# EAGLE design nintendo-hid (EAGLE 7.4.0)

## Sheet 1 of 5: MCU
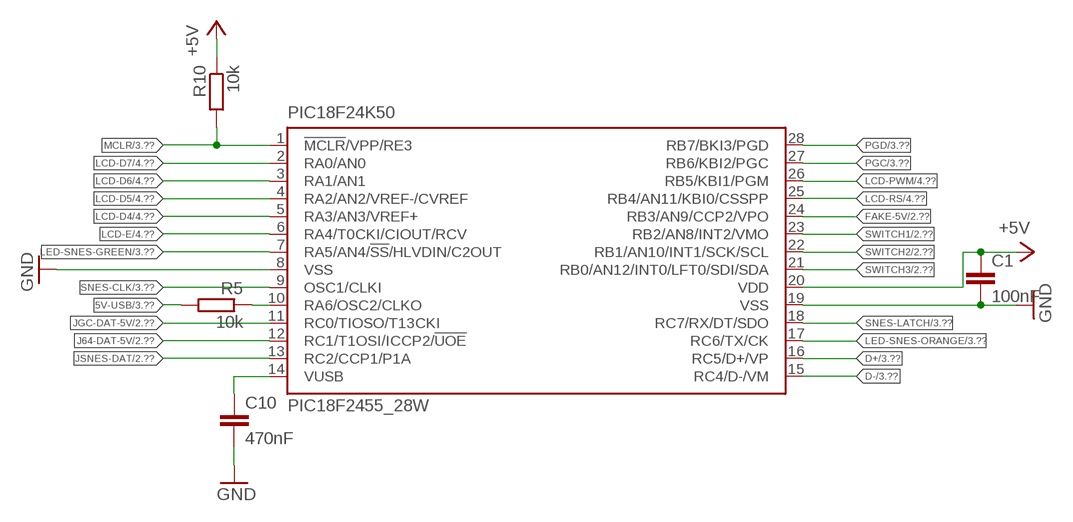
[diagram p0: schematic, sheet 1]

### Parts
C1  100nF  C-EUC0603  [C0603]
C10  470nF  C-EUC0603  [C0603]
PIC18F24K50  PIC18F2455_28W  [SO28W]
R5  10k  R-EU_R0603  [R0603]
R10  10k  R-EU_R0603  [R0603]

### Nets
5V-USB: R5.2 ; also sheet 3,5
+5V: C1.1 PIC18F24K50.20(VDD) R10.1 ; also sheet 2,3,4,5
D+: PIC18F24K50.16(RC5/D+/VP) ; also sheet 3
D-: PIC18F24K50.15(RC4/D-/VM) ; also sheet 3
FAKE-5V: PIC18F24K50.24(RB3/AN9/CCP2/VPO) ; also sheet 2
GND: C1.2 C10.2 PIC18F24K50.8(VSS) PIC18F24K50.19(VSS) ; also sheet 2,3,4,5
J64-DAT-5V: PIC18F24K50.12(RC1/T1OSI/ICCP2/!UOE) ; also sheet 2
JGC-DAT-5V: PIC18F24K50.11(RC0/TIOSO/T13CKI) ; also sheet 2
JSNES-DAT: PIC18F24K50.13(RC2/CCP1/P1A) ; also sheet 2,3
LCD-D4: PIC18F24K50.5(RA3/AN3/VREF+) ; also sheet 4
LCD-D5: PIC18F24K50.4(RA2/AN2/VREF-/CVREF) ; also sheet 4
LCD-D6: PIC18F24K50.3(RA1/AN1) ; also sheet 4
LCD-D7: PIC18F24K50.2(RA0/AN0) ; also sheet 4
LCD-E: PIC18F24K50.6(RA4/T0CKI/CIOUT/RCV) ; also sheet 4
LCD-PWM: PIC18F24K50.26(RB5/KBI1/PGM) ; also sheet 4
LCD-RS: PIC18F24K50.25(RB4/AN11/KBI0/CSSPP) ; also sheet 4
LED-SNES-GREEN: PIC18F24K50.7(RA5/AN4/!SS!/HLVDIN/C2OUT) ; also sheet 3
LED-SNES-ORANGE: PIC18F24K50.17(RC6/TX/CK) ; also sheet 3
MCLR: PIC18F24K50.1(!MCLR!/VPP/RE3) R10.2 ; also sheet 3
N$1: C10.1 PIC18F24K50.14(VUSB)
PGC: PIC18F24K50.27(RB6/KBI2/PGC) ; also sheet 3
PGD: PIC18F24K50.28(RB7/BKI3/PGD) ; also sheet 3
SNES-CLK: PIC18F24K50.9(OSC1/CLKI) ; also sheet 3
SNES-LATCH: PIC18F24K50.18(RC7/RX/DT/SDO) ; also sheet 3
SWITCH1: PIC18F24K50.23(RB2/AN8/INT2/VMO) ; also sheet 2
SWITCH2: PIC18F24K50.22(RB1/AN10/INT1/SCK/SCL) ; also sheet 2
SWITCH3: PIC18F24K50.21(RB0/AN12/INT0/LFT0/SDI/SDA) ; also sheet 2
USB-SENSE: PIC18F24K50.10(RA6/OSC2/CLKO) R5.1

## Sheet 2 of 5: SIGNALS
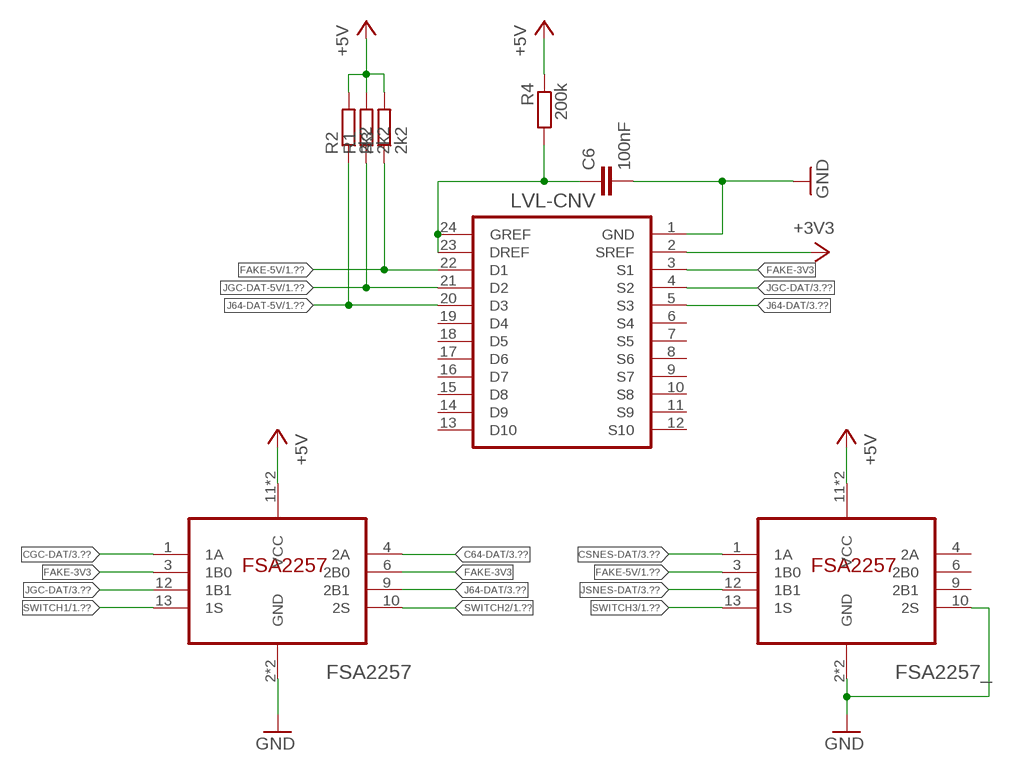
[diagram p1: schematic, sheet 2]

### Parts
C6  100nF  C-EUC0603  [C0603]
FSA2257  FSA2257MTCX  [TSSOP14]
FSA2257_  FSA2257MTCX  [TSSOP14]
LVL-CNV  GTL2010  [TSSOP24]
R1  2k2  R-EU_R0603  [R0603]
R2  2k2  R-EU_R0603  [R0603]
R3  2k2  R-EU_R0603  [R0603]
R4  200k  R-EU_R0603  [R0603]

### Nets
+3V3: LVL-CNV.2(SREF) ; also sheet 3,5
+5V: FSA2257.11(VCC) FSA2257.14(VCC) FSA2257_.11(VCC) FSA2257_.14(VCC) R1.2 R2.2 R3.2 R4.1 ; also sheet 1,3,4,5
C64-DAT: FSA2257.4(2A) ; also sheet 3
CGC-DAT: FSA2257.1(1A) ; also sheet 3
CSNES-DAT: FSA2257_.1(1A) ; also sheet 3
FAKE-3V3: FSA2257.3(1B0) FSA2257.6(2B0) LVL-CNV.3(S1)
FAKE-5V: FSA2257_.3(1B0) LVL-CNV.22(D1) R3.1 ; also sheet 1
GND: C6.2 FSA2257.2(GND) FSA2257.5(GND) FSA2257_.2(GND) FSA2257_.5(GND) FSA2257_.10(2S) LVL-CNV.1(GND) ; also sheet 1,3,4,5
J64-DAT: FSA2257.9(2B1) LVL-CNV.5(S3) ; also sheet 3
J64-DAT-5V: LVL-CNV.20(D3) R2.1 ; also sheet 1
JGC-DAT: FSA2257.12(1B1) LVL-CNV.4(S2) ; also sheet 3
JGC-DAT-5V: LVL-CNV.21(D2) R1.1 ; also sheet 1
JSNES-DAT: FSA2257_.12(1B1) ; also sheet 1,3
N$20: C6.1 LVL-CNV.23(DREF) LVL-CNV.24(GREF) R4.2
SWITCH1: FSA2257.13(1S) ; also sheet 1
SWITCH2: FSA2257.10(2S) ; also sheet 1
SWITCH3: FSA2257_.13(1S) ; also sheet 1
Unconnected: FSA2257_.4(2A) FSA2257_.6(2B0) FSA2257_.9(2B1) LVL-CNV.6(S4) LVL-CNV.7(S5) LVL-CNV.8(S6) LVL-CNV.9(S7) LVL-CNV.10(S8) LVL-CNV.11(S9) LVL-CNV.12(S10) LVL-CNV.13(D10) LVL-CNV.14(D9) LVL-CNV.15(D8) LVL-CNV.16(D7) LVL-CNV.17(D6) LVL-CNV.18(D5) LVL-CNV.19(D4)

## Sheet 3 of 5: CONNECTORS
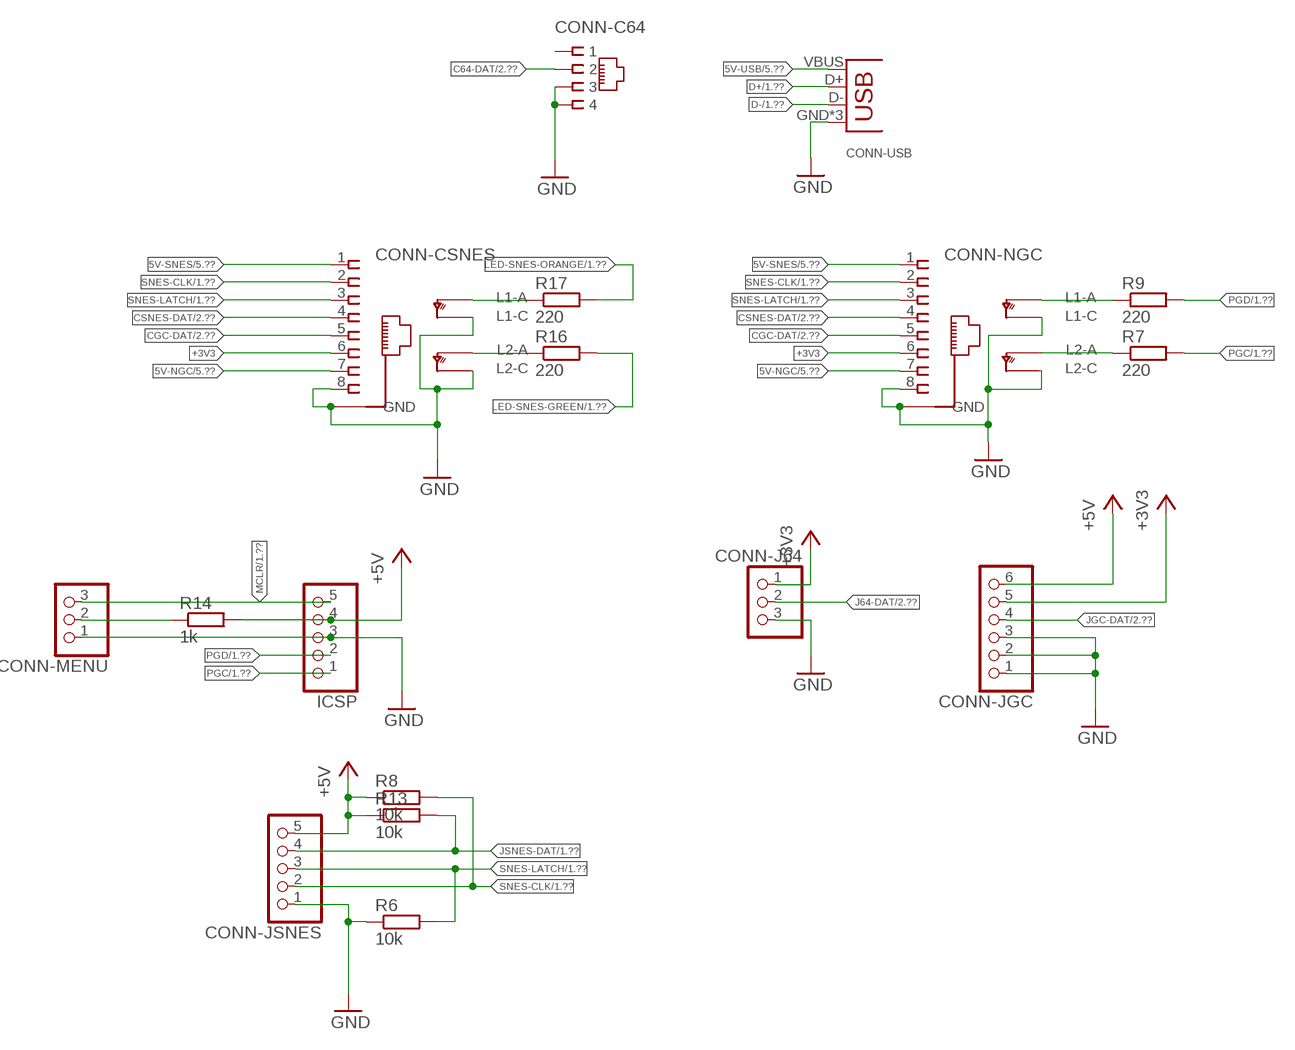
[diagram p2: schematic, sheet 3]

### Parts
CONN-C64  RJ11-6P4C  [RJ11-4C]
CONN-CSNES  RJ45-NIELS  [RJ45-NIELS]
CONN-J64  PINHD-1X3  [1X03]
CONN-JGC  PINHD-1X6  [1X06]
CONN-JSNES  PINHD-1X5  [1X05]
CONN-MENU  PINHD-1X3  [1X03]
CONN-NGC  RJ45-NIELS  [RJ45-NIELS]
CONN-USB  USB-B-NIELS  [USB-B-H]
ICSP  PINHD-1X5  [1X05]
R6  10k  R-EU_R0603  [R0603]
R7  220  R-EU_R0603  [R0603]
R8  10k  R-EU_R0603  [R0603]
R9  220  R-EU_R0603  [R0603]
R13  10k  R-EU_R0603  [R0603]
R14  1k  R-EU_R0603  [R0603]
R16  220  R-EU_R0603  [R0603]
R17  220  R-EU_R0603  [R0603]

### Nets
5V-NGC: CONN-CSNES.7 CONN-NGC.7 ; also sheet 5
5V-SNES: CONN-CSNES.1 CONN-NGC.1 ; also sheet 5
5V-USB: CONN-USB.VBUS ; also sheet 1,5
+3V3: CONN-CSNES.6 CONN-J64.1 CONN-JGC.5 CONN-NGC.6 ; also sheet 2,5
+5V: CONN-JGC.6 CONN-JSNES.5 ICSP.4 R8.1 R13.1 R14.2 ; also sheet 1,2,4,5
C64-DAT: CONN-C64.2 ; also sheet 2
CGC-DAT: CONN-CSNES.5 CONN-NGC.5 ; also sheet 2
CSNES-DAT: CONN-CSNES.4 CONN-NGC.4 ; also sheet 2
D+: CONN-USB.D+ ; also sheet 1
D-: CONN-USB.D- ; also sheet 1
GND: CONN-C64.3 CONN-C64.4 CONN-CSNES.8 CONN-CSNES.GND@5(GND) CONN-CSNES.GND@6(GND) CONN-CSNES.LED-GREEN-C(L2C) CONN-CSNES.LED-ORANGE-C(L1C) CONN-J64.3 CONN-JGC.1 CONN-JGC.2 CONN-JGC.3 CONN-JSNES.1 CONN-MENU.1 CONN-NGC.8 CONN-NGC.GND@5(GND) CONN-NGC.GND@6(GND) CONN-NGC.LED-GREEN-C(L2C) CONN-NGC.LED-ORANGE-C(L1C) CONN-USB.GND CONN-USB.GND@1(GND) CONN-USB.GND@2(GND) ICSP.3 R6.1 ; also sheet 1,2,4,5
J64-DAT: CONN-J64.2 ; also sheet 2
JGC-DAT: CONN-JGC.4 ; also sheet 2
JSNES-DAT: CONN-JSNES.4 R13.2 ; also sheet 1,2
LED-SNES-GREEN: R16.2 ; also sheet 1
LED-SNES-ORANGE: R17.2 ; also sheet 1
MCLR: CONN-MENU.3 ICSP.5 ; also sheet 1
N$4: CONN-CSNES.LED-ORANGE-A(L1A) R17.1
N$5: CONN-CSNES.LED-GREEN-A(L2A) R16.1
N$8: CONN-NGC.LED-ORANGE-A(L1A) R9.1
N$23: CONN-NGC.LED-GREEN-A(L2A) R7.1
PGC: ICSP.1 R7.2 ; also sheet 1
PGD: ICSP.2 R9.2 ; also sheet 1
PWR-LED: CONN-MENU.2 R14.1
SNES-CLK: CONN-CSNES.2 CONN-JSNES.2 CONN-NGC.2 R8.2 ; also sheet 1
SNES-LATCH: CONN-CSNES.3 CONN-JSNES.3 CONN-NGC.3 R6.2 ; also sheet 1
Unconnected: CONN-C64.1

## Sheet 4 of 5: LCD
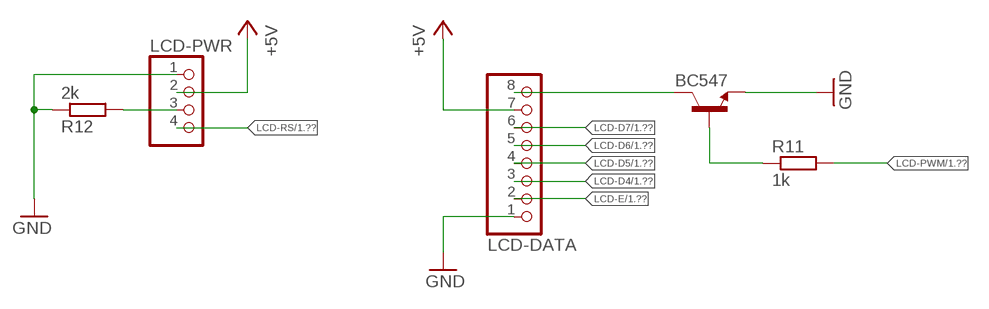
[diagram p3: schematic, sheet 4]

### Parts
BC547  BC547  [TO92]
LCD-DATA  PINHD-1X8  [1X08]
LCD-PWR  PINHD-1X4  [1X04]
R11  1k  R-EU_R0603  [R0603]
R12  2k  R-EU_R0603  [R0603]

### Nets
+5V: LCD-DATA.7 LCD-PWR.2 ; also sheet 1,2,3,5
C: BC547.3(C) LCD-DATA.8
GND: BC547.1(E) LCD-DATA.1 LCD-PWR.1 R12.1 ; also sheet 1,2,3,5
LCD-D4: LCD-DATA.3 ; also sheet 1
LCD-D5: LCD-DATA.4 ; also sheet 1
LCD-D6: LCD-DATA.5 ; also sheet 1
LCD-D7: LCD-DATA.6 ; also sheet 1
LCD-E: LCD-DATA.2 ; also sheet 1
LCD-PWM: R11.2 ; also sheet 1
LCD-RS: LCD-PWR.4 ; also sheet 1
N$19: BC547.2(B) R11.1
VEE: LCD-PWR.3 R12.2

## Sheet 5 of 5: POWER
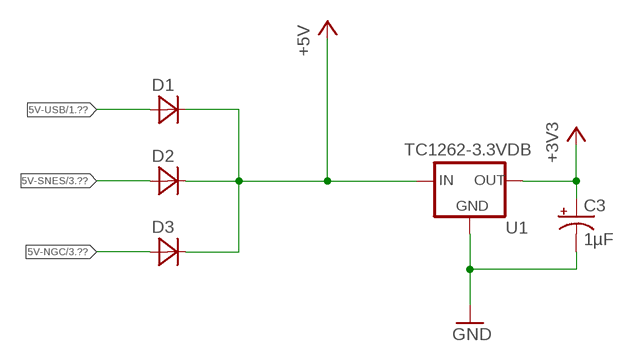
[diagram p4: schematic, sheet 5]

### Parts
C3  1µF  47UF-50V-20%(ELECT)  [PANASONIC_D]
D1  MBR120VLSFT1G  [SOD123]
D2  MBR120VLSFT1G  [SOD123]
D3  MBR120VLSFT1G  [SOD123]
U1  TC1262-3.3VDB  [SOT230P700X180-4N]

### Nets
5V-NGC: D3.2(A) ; also sheet 3
5V-SNES: D2.2(A) ; also sheet 3
5V-USB: D1.2(A) ; also sheet 1,3
+3V3: C3.+ U1.3(OUT) ; also sheet 2,3
+5V: D1.1(C) D2.1(C) D3.1(C) U1.1(IN) ; also sheet 1,2,3,4
GND: C3.- U1.2(GND) U1.4(GND) ; also sheet 1,2,3,4

## Library data of the parts
BC547 = transistor-npn:BC547*: NPN Transistor
C1 C6 C10 = resistor:C-EU: CAPACITOR, European symbol
C3 = SparkFun-Capacitors:47UF-50V-20%(ELECT): CAP-10547; PROD_ID: CAP-10547
CONN-C64 = frank:RJ11-6P4C
CONN-CSNES CONN-NGC = frank:RJ45-NIELS
CONN-J64 CONN-MENU = pinhead:PINHD-1X3: PIN HEADER
CONN-JGC = pinhead:PINHD-1X6: PIN HEADER
CONN-JSNES ICSP = pinhead:PINHD-1X5: PIN HEADER
CONN-USB = frank:USB: USB Connectors
D1-D3 = frank:MBR120VLSFT1G: DIODE, SCHOTTKY, 1A, 20V, SOD-123FL
FSA2257 FSA2257_ = frank:FSA2257MTCX
LCD-DATA = pinhead:PINHD-1X8: PIN HEADER
LCD-PWR = pinhead:PINHD-1X4: PIN HEADER
LVL-CNV = frank:GTL2010
PIC18F24K50 = microchip:PIC18F2*_28: USB Microcontrollers with nanoWatt Technology High-Performance, Enhanced Flash, 28/40/44-Pin, Source: http://ww1.microchip.com/downloads/en/devicedoc/39632c.pdf; MF: MICROCHIP; MPN: PIC18F2455-I/SO; OC_FARNELL: 1579598; OC_NEWARK: 64J3768
R1-R14 R16 R17 = resistor:R-EU_: RESISTOR, European symbol
U1 = frank:TC1262-3.3VDB: IC, 500mA Fixed Output CMOS LDO,3.3V,SOT-223, 3-lead; MPN: TC1262-3.3VDB; OC_FARNELL: 1852183; OC_NEWARK: 53R0370; PACKAGE: SOT-223-3; SUPPLIER: Microchip

## Net classes
0 default: width 0.152 mm, drill 0.25 mm, clearance 0.152 mm

## Board
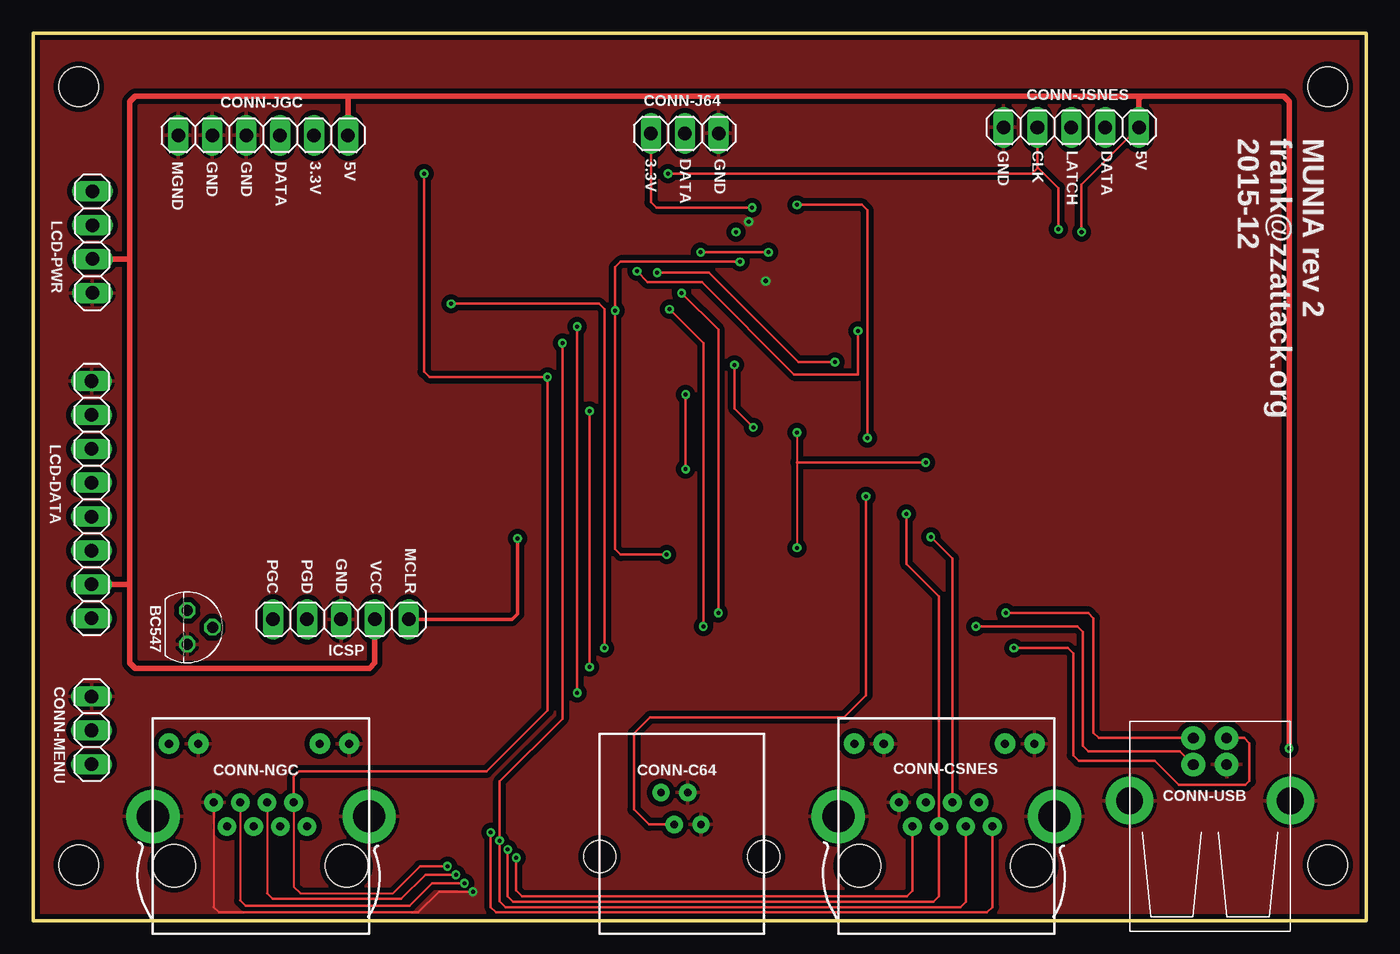
[diagram p5: board, top side]
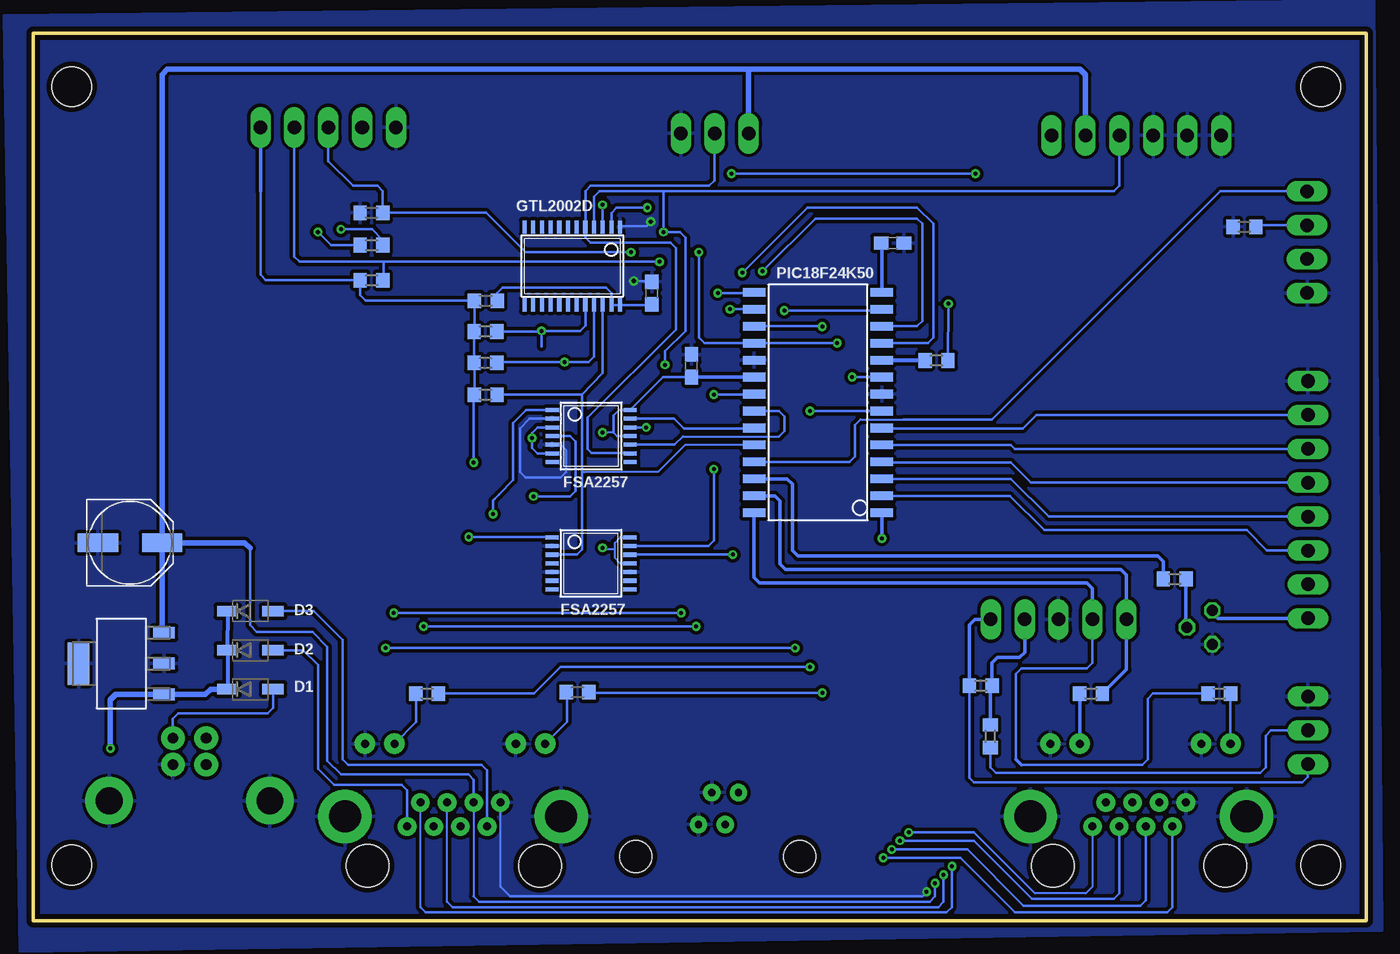
[diagram p6: board, bottom side, seen from below]

Size 99.87 x 66.5 mm. Coordinates in mm from the lower left corner, seen from the top.
Outline: 99.87,0 0,0 0,66.5 99.87,66.5 99.87,0
Copper layers (1*16): Top 0.0356mm / dielectric 1.5011mm / Bottom 0.0356mm
Design rules "pcbway 6mil 0.3mm drills *": minimum track width 6mil, minimum drill 0.25mm, track to track 6mil, track to pad 6mil, pad to pad 6mil, via to via 6mil, smd to smd 6mil, copper to edge 15mil, drill to drill 6mil, minimum pad ring 7mil, minimum via ring 7mil, stop-mask expansion 4mil, vias tented up to drill 999mil, thermal gap 10mil
Holes 3 mm at 3.4,62.5 3.4,4.17 97,62.5 97,4.17

### Footprints (pad centres in the part's own frame; a part is rotated, then mirrored left to right if it is on the bottom)
TO92 = drill 0.813 octagon: 1 1.27,0; 2 0,1.905; 3 -1.27,0
C0603 = smd 1.1 x 1: 1 -0.85,0; 2 0.85,0
PANASONIC_D = smd 3 x 1.4: + 2.4,0; - -2.4,0
RJ11-4C = drill 0.55 pad 1.3: 1 4.6,10.6; 2 5.6,8.2; 3 6.6,10.6; 4 7.6,8.2 | hole 2.4: 0,5.8; 12.3,5.8
RJ45-NIELS = drill 0.6 pad 1.397: 1 11.55,8.05; 2 10.55,9.85; 3 9.55,8.05; 4 8.55,9.85; 5 7.55,8.05; 6 6.55,9.85; 7 5.55,8.05; 8 4.55,9.85 | drill 2.4 pad 4: GND@5 0,8.8; GND@6 16.2,8.8 | drill 0.6 pad 1.524: LED-GREEN-A 12.5,14.26; LED-GREEN-C 14.7,14.26; LED-ORANGE-A 1.2,14.26; LED-ORANGE-C 3.4,14.26 | hole 3.2: 1.6,5.1; 14.5,5.1
1X03 = drill 1.016 long: 1 -2.54,0; 2 0,0; 3 2.54,0
1X06 = drill 1.016 long: 1 -6.35,0; 2 -3.81,0; 3 -1.27,0; 4 1.27,0; 5 3.81,0; 6 6.35,0
1X05 = drill 1.016 long: 1 -5.08,0; 2 -2.54,0; 3 0,0; 4 2.54,0; 5 5.08,0
USB-B-H = drill 0.8 pad 1.778: D+ 0,1.25; D- 1.981,1.25; GND 0,-1.25; VBUS 1.981,-1.25 | drill 2 pad 3.556: GND@1 -2.718,-6.02; GND@2 -2.718,6.02
SOD123 = smd 1.6 x 0.8: 1 -1.7,0; 2 1.7,0
TSSOP14 = smd 0.305 x 0.991: 1 -1.95,-2.918; 2 -1.3,-2.918; 3 -0.65,-2.918; 4 0,-2.918; 5 0.65,-2.918; 6 1.3,-2.918; 7 1.95,-2.918; 8 1.95,2.918; 9 1.3,2.918; 10 0.65,2.918; 11 0,2.918; 12 -0.65,2.918; 13 -1.3,2.918; 14 -1.95,2.918
1X08 = drill 1.016 long: 1 -8.89,0; 2 -6.35,0; 3 -3.81,0; 4 -1.27,0; 5 1.27,0; 6 3.81,0; 7 6.35,0; 8 8.89,0
1X04 = drill 1.016 long: 1 -3.81,0; 2 -1.27,0; 3 1.27,0; 4 3.81,0
TSSOP24 = smd 0.305 x 0.991: 1 -3.575,-2.918; 2 -2.925,-2.918; 3 -2.275,-2.918; 4 -1.625,-2.918; 5 -0.975,-2.918; 6 -0.325,-2.918; 7 0.325,-2.918; 8 0.975,-2.918; 9 1.625,-2.918; 10 2.275,-2.918; 11 2.925,-2.918; 12 3.575,-2.918; 13 3.575,2.918; 14 2.925,2.918; 15 2.275,2.918; 16 1.625,2.918; 17 0.975,2.918; 18 0.325,2.918; 19 -0.325,2.918; 20 -0.975,2.918; 21 -1.625,2.918; 22 -2.275,2.918; 23 -2.925,2.918; 24 -3.575,2.918
SO28W = smd 0.65 x 1.7: 1 -7.62,-4.78; 2 -6.35,-4.78; 3 -5.08,-4.78; 4 -3.81,-4.78; 5 -2.54,-4.78; 6 -1.27,-4.78; 7 0,-4.78; 8 1.27,-4.78; 9 2.54,-4.78; 10 3.81,-4.78; 11 5.08,-4.78; 12 6.35,-4.78; 13 7.62,-4.78; 14 8.89,-4.78; 15 8.89,4.78; 16 7.62,4.78; 17 6.35,4.78; 18 5.08,4.78; 19 3.81,4.78; 20 2.54,4.78; 21 1.27,4.78; 22 0,4.78; 23 -1.27,4.78; 24 -2.54,4.78; 25 -3.81,4.78; 26 -5.08,4.78; 27 -6.35,4.78; 28 -7.62,4.78
R0603 = smd 1 x 1.1: 1 -0.85,0; 2 0.85,0
SOT230P700X180-4N = smd 1.626 x 0.889: 1 -3.2,2.311; 2 -3.2,0; 3 -3.2,-2.311 | smd 1.626 x 3.175: 4 3.2,0

### Placement (x,y rotation side)
BC547  11.52,21.98 270 top
C1  50.56,41.58 90 bottom
C3  92.63,28.32 0 bottom
C6  53.52,47.03 90 bottom
C10  35.49,50.78 0 bottom
CONN-C64  42.44,-1 0 top
CONN-CSNES  60.32,-1 0 top
CONN-J64  48.82,59 0 top
CONN-JGC  17.22,58.86 0 top
CONN-JSNES  77.78,59.46 0 top
CONN-MENU  4.36,14.26 270 top
CONN-NGC  8.96,-1 0 top
CONN-USB  88.17,11.7 90 top
D1  83.62,17.35 0 bottom
D2  83.62,20.27 0 bottom
D3  83.62,23.19 0 bottom
FSA2257  58.08,36.32 270 bottom
FSA2257_  58.1,26.78 270 bottom
ICSP  23.05,22.58 0 top
LCD-DATA  4.36,31.55 270 top
LCD-PWR  4.42,50.85 90 top
LVL-CNV  59.49,49.06 180 bottom
PIC18F24K50  41.08,38.19 90 bottom
R1  66,41.8 180 bottom
R2  66,44.15 180 bottom
R3  65.97,39.41 180 bottom
R4  65.97,46.46 0 bottom
R5  32.19,41.98 0 bottom
R6  74.54,53.05 0 bottom
R7  20.62,17.02 0 bottom
R8  74.54,50.62 0 bottom
R9  11,17.02 180 bottom
R10  28.88,17.61 180 bottom
R11  14.34,25.61 180 bottom
R12  9.12,52 0 bottom
R13  74.54,48 0 bottom
R14  28.16,13.82 90 bottom
R16  70.37,17.02 0 bottom
R17  59.09,17.12 0 bottom
U1  93.28,19.27 180 bottom

### Tracks (layer width: path | path; a pad name or v marks a point on that pad's centre or on a via)
5V-NGC  (via drill 0.3)
  Top 0.203: CONN-CSNES.7 65.87,2.23 65.46,1.83 36.62,1.83 36.19,2.26 v36.19,4.7
  Bottom 0.203: CONN-NGC.7 14.51,1.02 14.92,0.61 26.3,0.61 30.39,4.7 v36.19,4.7 | 81.91,23.16 D3.2 78.87,23.19 76.71,21.03 76.71,12.09 76.3,11.68 66.28,11.68 65.87,11.28 CONN-CSNES.7
5V-SNES  (via drill 0.3)
  Top 0.203: v34.28,6.6 34.28,1.02 34.69,0.61 71.46,0.61 71.87,1.02 CONN-CSNES.1
  Bottom 0.152: CONN-NGC.1 20.51,2.54 21.02,2.03 24.81,2.03 29.38,6.6
  Bottom 0.203: v34.28,6.6 29.38,6.6 | D2.2 79.67,20.27 78.55,19.15 78.55,11.38 77.33,10.16 72.28,10.16 71.87,9.75 CONN-CSNES.1
5V-USB  (via drill 0.3)
  Top 0.203: v31.31,46.23 42.38,46.23 42.79,45.82 v42.79,20.42 | CONN-USB.VBUS 90.73,13.68 91.14,13.28 91.14,10.46 90.83,10.16 85.85,10.16 84.02,11.99 78.33,11.99 77.93,12.39 77.93,20.02 77.52,20.42 v73.47,20.42
  Bottom 0.203: R5.2 v31.31,46.23 | v42.79,20.42 v73.47,20.42 | CONN-USB.VBUS 89.42,15.14 89.02,15.54 82.32,15.54 81.92,15.95 D1.2
+3V3  (via drill 0.3)
  Top 0.152: CONN-NGC.6 15.51,1.52
  Top 0.203: 15.51,1.52 15.92,1.12 28.21,1.12 29.89,2.79 v32.3,2.79 | CONN-J64.1 46.28,53.85 46.69,53.44 v53.86,53.44
  Bottom 0.152: CONN-CSNES.6 66.87,1.83
  Bottom 0.203: v32.3,2.79 32.3,1.83 32.71,1.42 66.46,1.42 66.87,1.83 | U1.3 90.23,21.73 | CONN-CSNES.6 66.87,10.57 67.28,10.97 76.83,10.97 77.84,11.99 77.84,20.52 78.96,21.64 83.12,21.64 83.63,22.15 83.63,27.91 | 56.61,52.02 LVL-CNV.2 56.56,53.03 56.16,53.44 v53.86,53.44
  Bottom 0.406: 90.23,21.73 C3.+ | 46.24,59.04 CONN-J64.1 46.28,63.77 46.24,63.8 | C3.+ 90.16,28.25 | 46.24,63.8 21.44,63.8 21.03,63.4 CONN-JGC.5 | 46.24,63.8 89.83,63.8 90.23,63.4 C3.+ | 83.63,27.91 84.04,28.32 C3.+
+5V  (via drill 0.3)
  Top 0.152: v57.22,36.58 57.22,34.34 v57.22,27.94
  Top 0.203: 57.22,34.34 v66.87,34.34 | v78.55,51.61 78.55,55.15 CONN-JSNES.5
  Top 0.406: ICSP.4 25.59,19.3 25.18,18.9 7.64,18.9 7.23,19.3 7.23,25.3 | CONN-JGC.6 23.57,61.76 23.59,61.77 | 23.59,61.77 83.02,61.77 | 83.02,61.77 93.69,61.77 94.1,61.37 v94.1,12.9 | CONN-JSNES.5 82.86,61.61 83.02,61.77 | 7.23,25.3 7.23,49.48 | 7.23,49.48 7.23,61.37 7.64,61.77 23.59,61.77 | LCD-PWR.2 7.12,49.58 7.23,49.48 | LCD-DATA.7 7.13,25.2 7.23,25.3
  Bottom 0.152: FSA2257_.11 55.9,26.78 56.3,27.18 56.3,27.84 | 56.3,27.84 56.3,28.32 55.9,28.73 FSA2257_.14 | 56.4,36.58 v57.22,36.58 | v57.22,27.94 57.12,27.84 56.3,27.84
  Bottom 0.203: U1.1 | FSA2257.11 56.15,36.32 56.4,36.58 56.4,37.86 56,38.27 FSA2257.14 52.7,40.73 C1.1 | 66.82,44.18 R2.2 | R2.2 R1.2 66.82,41.57 R3.2 66.87,39.37 v66.87,34.34 | R2.2 66.82,44.19 R4.1 74.98,46.46 75.39,46.87 R13.1 82.45,48 82.86,48.41 82.86,54.67 | R8.1 77.56,50.62 v78.55,51.61
  Bottom 0.254: 82.86,54.67 CONN-JSNES.5 | ICSP.4 25.59,20.12 25.99,19.71 27.63,19.71 28.03,19.3 R10.1 28.16,17.48 R14.2 | 45.89,40.71 PIC18F24K50.20 C1.1
  Bottom 0.305: D3.1 85.34,20.29 D2.1 D1.1
  Bottom 0.406: U1.1 93.69,16.96 94.1,16.55 v94.1,12.9 | U1.1 87,16.95 86.61,17.35 D1.1
C
  Bottom 0.254: LCD-DATA.8 11.12,22.66 11.52,23.07 BC547.3
C64-DAT  (via drill 0.3)
  Top 0.203: v62.4,31.8 62.4,16.88 60.76,15.24 46.23,15.24 45.01,14.02 45.01,8.33 46.14,7.2 CONN-C64.2
  Bottom 0.203: FSA2257.4 59.66,36.32 59.25,35.91 59.25,32.21 59.66,31.8 v62.4,31.8
CGC-DAT  (via drill 0.3)
  Top 0.203: v35.55,5.33 35.55,1.83 35.96,1.42 67.46,1.42 67.87,1.83 CONN-CSNES.5 67.87,24.28 65.43,26.72 v65.43,30.48
  Bottom 0.203: CONN-NGC.5 16.51,1.52 16.92,1.12 25.67,1.12 29.89,5.33 v35.55,5.33 | FSA2257.1 62.94,38.27 63.92,37.29 63.92,33.01 64.97,31.95 65.33,31.6 65.43,31.5 v65.43,30.48
CSNES-DAT  (via drill 0.3)
  Top 0.152: CONN-NGC.4 17.51,2.03
  Top 0.203: 17.51,2.03 17.92,1.63 27.57,1.63 29.38,3.43 v31.66,3.43 | CONN-CSNES.4 68.87,27.13 v67.25,28.75
  Bottom 0.152: 68.87,1.42 CONN-CSNES.4
  Bottom 0.203: v31.66,3.43 31.66,1.42 32.07,1.02 68.46,1.02 68.87,1.42 | FSA2257_.1 61.04,28.75 v67.25,28.75
D+  (via drill 0.3)
  Top 0.203: v47.67,45.82 50.21,43.28 v50.21,22.05 | v70.63,22.05 78.23,22.05 78.64,21.64 78.64,13.11 79.05,12.7 85.92,12.7 CONN-USB.D+
  Bottom 0.203: v70.63,22.05 v50.21,22.05 | PIC18F24K50.16 45.87,45.82 v47.67,45.82
D-  (via drill 0.3)
  Top 0.203: v51.32,23.06 51.32,44.3 v48.58,47.04 | CONN-USB.D- 79.86,13.68 79.45,14.09 79.45,22.66 79.05,23.06 v72.86,23.06
  Bottom 0.203: v72.86,23.06 v51.32,23.06 | v48.58,47.04 45.9,47.04 PIC18F24K50.15
FAKE-3V3  (via drill 0.3)
  Top 0.203: v62.5,36.17 62.5,53.24 62.09,53.65 v57.22,53.65
  Bottom 0.203: v57.22,53.65 LVL-CNV.3 | FSA2257.6 62.09,35.02 62.5,35.43 v62.5,36.17 62.5,36.56 62.09,36.97 FSA2257.3
FAKE-5V
  Bottom 0.152: PIC18F24K50.24 51.03,35.65 53.05,33.63 58.57,33.63
  Bottom 0.203: 62.8,39.42 62.3,39.42 | 62.3,39.42 58.74,39.42 | FSA2257_.3 59.15,27.43 58.74,27.83 58.74,33.63 | 58.74,33.63 58.74,39.42 | 58.57,33.63 58.74,33.63 | R3.1 62.31,39.41 62.3,39.42 | LVL-CNV.22 57.21,41.05 58.74,39.42
GND  (via drill 0.3, 0.33)
  Top 0.152: CONN-NGC.8 13.51,1.02
  Top 0.203: 13.51,1.02 13.92,0.61 28.84,0.61 30.39,2.16 v32.93,2.16
  Bottom 0.152: 64.87,2.54 CONN-CSNES.8
  Bottom 0.203: v53.61,52.39 53.93,52.07 55.83,52.07 LVL-CNV.1 | v54.88,47.94 53.61,47.94 C6.2 | 64.87,2.54 64.16,1.83 33.27,1.83 v32.93,2.16 | FSA2257.5 60.37,35.67 59.96,35.26 59.96,33.63 60.37,33.22 63.01,33.22 63.41,33.63 63.41,36.88 62.67,37.62 FSA2257.2
  pour Bottom (isolate 0.254): -1.16,-0.71 -0.56,68.94 102.06,67.83 100.86,-2.3
  pour Top (isolate 0.381): -1.04,-0.72 -1.34,69.24 103.62,68.42 101.96,-1.76
J64-DAT
  Bottom 0.152: 55.13,35.05 FSA2257.9
  Bottom 0.203: CONN-J64.2 48.82,55.47 49.23,55.07 58.11,55.07 58.51,54.66 LVL-CNV.5 58.51,51.21 58.11,50.8 52.14,50.8 51.73,50.39 51.73,44.3 58.33,37.69 58.33,35.36 58.03,35.05 55.13,35.05
J64-DAT-5V  (via drill 0.3)
  Top 0.203: v45.23,48.67 46.04,47.85 50.1,47.85 57.01,40.95 61.79,40.95 v61.79,44.2
  Bottom 0.203: PIC18F24K50.12 33.65,44.54 33.24,44.95 33.24,52.22 33.65,52.63 41.27,52.63 v45.23,48.67 | v61.79,44.2 61.79,43.04 | LVL-CNV.20 58.51,44.6 58.92,44.2 v61.79,44.2 | v61.79,44.2 61.83,44.15 R2.1
JGC-DAT  (via drill 0.3)
  Top 0.203: v53.95,36.97 52.54,38.38 v52.54,41.66
  Bottom 0.203: LVL-CNV.4 57.86,54.25 57.46,54.66 52.65,54.66 | 52.65,54.66 18.9,54.66 18.49,55.07 CONN-JGC.4 | FSA2257.12 v53.95,36.97 | 52.65,54.66 v52.65,51.61 51.43,51.61 51.02,51.21 51.02,44.2 52.54,42.67 v52.54,41.66
JGC-DAT-5V  (via drill 0.3)
  Top 0.203: v46.75,48.56 50.61,48.56 57.32,41.86 v60.06,41.86
  Bottom 0.203: LVL-CNV.21 57.86,42.27 58.27,41.86 v60.06,41.86 65.09,41.86 R1.1 | PIC18F24K50.11 32.83,43.27 32.43,43.68 32.43,52.22 33.65,53.44 41.88,53.44 v46.75,48.56
JSNES-DAT  (via drill 0.3)
  Top 0.203: v47.46,27.43 44.01,27.43 43.6,27.84 v43.6,45.72 43.6,48.97 44.01,49.38 v52.95,49.38
  Bottom 0.203: CONN-JSNES.4 80.32,49.78 79.91,49.38 73.63,49.38 | FSA2257_.12 v47.46,27.43 | v43.6,45.72 36.39,45.72 PIC18F24K50.13 | 73.63,49.38 v52.95,49.38 | R13.2 73.63,48.06 73.63,49.38
LCD-D4
  Bottom 0.203: PIC18F24K50.5 36.29,35.66 26.64,35.66 26.33,35.36 LCD-DATA.3
LCD-D5
  Bottom 0.203: LCD-DATA.4 25.11,32.82 26.64,34.34 36.26,34.34 PIC18F24K50.4
LCD-D6
  Bottom 0.203: LCD-DATA.5 23.79,30.28 26.62,33.11 PIC18F24K50.3
LCD-D7
  Bottom 0.203: PIC18F24K50.2 26.68,31.84 24.09,29.26 8.96,29.26 7.44,27.74 LCD-DATA.6
LCD-E
  Bottom 0.203: PIC18F24K50.6 36.26,36.88 25.72,36.88 24.7,37.9 LCD-DATA.2
LCD-PWM
  Bottom 0.254: PIC18F24K50.26 43.4,33.11 42.99,32.71 42.99,27.74 42.59,27.33 15.6,27.33 15.2,26.92 R11.2
LCD-RS
  Bottom 0.152: 37.91,37.57 34.66,37.57
  Bottom 0.203: PIC18F24K50.25 38.73,34.38 38.32,34.79 38.32,37.16 37.91,37.57 | 34.66,37.57 28.04,37.57 10.94,54.66 LCD-PWR.4
LED-SNES-GREEN  (via drill 0.3)
  Top 0.203: v41.67,38.2 v41.67,19
  Bottom 0.203: R16.2 62.35,17.02 60.37,19 v41.67,19 | PIC18F24K50.7 v41.66,38.19 v41.67,38.2
LED-SNES-ORANGE  (via drill 0.3)
  Top 0.203: v40.76,44.53 v40.76,17.07
  Bottom 0.203: R17.2 58.19,17.07 v40.76,17.07 | 45.84,44.53 PIC18F24K50.17 40.77,44.54 v40.76,44.53
MCLR  (via drill 0.3)
  Top 0.254: v36.29,28.65 36.29,22.98 35.88,22.58 ICSP.5
  Bottom 0.203: R10.2 29.73,10.72 29.38,10.36 4.77,10.36 4.36,10.77 CONN-MENU.3
  Bottom 0.254: ICSP.5 29.33,22.58 29.73,22.17 R10.2 | PIC18F24K50.1 36.29,30.56 v36.29,28.65
N$1
  Bottom 0.254: C10.1 36.3,50.73 PIC18F24K50.14
N$4
  Bottom 0.203: R17.1 59.9,17.07 59.9,14.89 CONN-CSNES.LED-ORANGE-A
N$5
  Bottom 0.203: R16.1 71.19,16.93 71.19,14.89 CONN-CSNES.LED-GREEN-A
N$8
  Bottom 0.203: R9.1 CONN-NGC.LED-ORANGE-A
N$19
  Bottom 0.254: R11.1 13.49,22.05 BC547.2
N$20
  Bottom 0.203: C6.1 53.56,46.15 LVL-CNV.24 LVL-CNV.23 56.56,47.04 56.97,47.45 64.71,47.45 65.12,47.04 R4.2
N$23
  Bottom 0.203: R7.1 21.54,16.83 21.46,16.83
  Bottom 0.254: 21.46,16.96 21.46,16.83 CONN-NGC.LED-GREEN-A
PGC
  Bottom 0.254: R7.2 17.97,18.82 ICSP.1 17.97,25.91 18.37,26.31 43.5,26.31 43.91,26.72 43.91,31.44 44.31,31.84 PIC18F24K50.27
PGD
  Bottom 0.203: ICSP.2 20.51,19.3 20.91,18.9 25.82,18.9 26.23,18.49 26.23,12.09 | R9.2 15.97,17.02 16.37,16.61 16.37,12.09 16.78,11.68 25.82,11.68
  Bottom 0.254: 25.82,11.68 26.23,12.09 | PIC18F24K50.28 45.86,25.7 45.45,25.3 20.91,25.3 20.51,24.89 ICSP.2
PWR-LED
  Bottom 0.203: CONN-MENU.2 7.13,14.26 7.53,13.85 7.53,11.48 7.94,11.07 27.75,11.07 28.16,11.48 R14.1
SNES-CLK  (via drill 0.3)
  Top 0.152: CONN-NGC.2 19.51,2.54 20.02,2.03 26.94,2.03 28.97,4.06
  Top 0.203: 28.97,4.06 v31.03,4.06 | CONN-NGC.2 19.51,10.77 19.92,11.18 33.95,11.18 38.52,15.75 v38.52,40.74 29.68,40.74 29.28,41.15 v29.28,55.98 | CONN-JSNES.2 75.24,56.49 | 75.24,56.49 75.24,56.39 74.83,55.98 v47.56,55.98 | v76.83,51.82 76.83,54.9 75.24,56.49
  Bottom 0.152: 70.87,1.02 CONN-CSNES.2
  Bottom 0.203: v31.03,4.06 31.03,1.02 31.44,0.61 70.46,0.61 70.87,1.02 | v38.52,40.74 36.31,40.74 PIC18F24K50.9 | 75.24,58.26 CONN-JSNES.2 | v47.56,55.98 v29.28,55.98 | R8.2 73.69,51.02 74.49,51.82 v76.83,51.82
SNES-LATCH  (via drill 0.3)
  Top 0.203: CONN-CSNES.3 69.87,1.42 69.46,1.02 35.37,1.02 34.94,1.45 v34.94,5.99 34.94,10.44 39.64,15.14 v39.64,43.28 | v55.08,50.09 v50,50.09
  Bottom 0.203: CONN-NGC.3 18.51,2.03 18.92,1.63 25.04,1.63 29.4,5.99 v34.94,5.99 | v39.64,43.28 45.85,43.28 PIC18F24K50.18 49.6,43.27 50,43.68 v50,50.09 | v55.08,50.09 62.99,50.09 65.95,53.05 R6.2 73.69,54.66 74.1,55.07 75.91,55.07 77.78,56.94 CONN-JSNES.3
SWITCH1
  Bottom 0.203: FSA2257.13 51.86,37.62 51.12,36.88 45.9,36.88 PIC18F24K50.23
SWITCH2
  Bottom 0.152: 51.2,36.3 44.01,36.3
  Bottom 0.203: FSA2257.10 51.82,35.67 51.2,36.3 | PIC18F24K50.22 44.01,38.19 43.6,37.79 43.6,36.7 44.01,36.3
SWITCH3  (via drill 0.3)
  Top 0.203: v48.89,39.42 v48.89,33.83
  Bottom 0.203: PIC18F24K50.21 45.9,39.42 v48.89,39.42 | v48.89,33.83 48.89,28.48 49.29,28.08 FSA2257_.13
USB-SENSE
  Bottom 0.305: R5.1 36.27,41.98 PIC18F24K50.10
VEE
  Bottom 0.203: LCD-PWR.3 8.15,52.12 R12.2

### Text on the board
tNames: MUNIA rev 2 / frank@zzattack.org / 2015-12 | 5V / / DATA / / LATCH / / CLK / / GND | 5V / / 3.3V / / DATA / / GND / / GND / / MGND | GND / / DATA / / 3.3V | MCLR / / VCC / / GND / / PGD / / PGC
bNames: GTL2002D | FSA2257 | FSA2257